# Altium schematic sheet DRL_Circuit.SchDoc
size A4; SheetNumber: 4; SheetTotal: 7
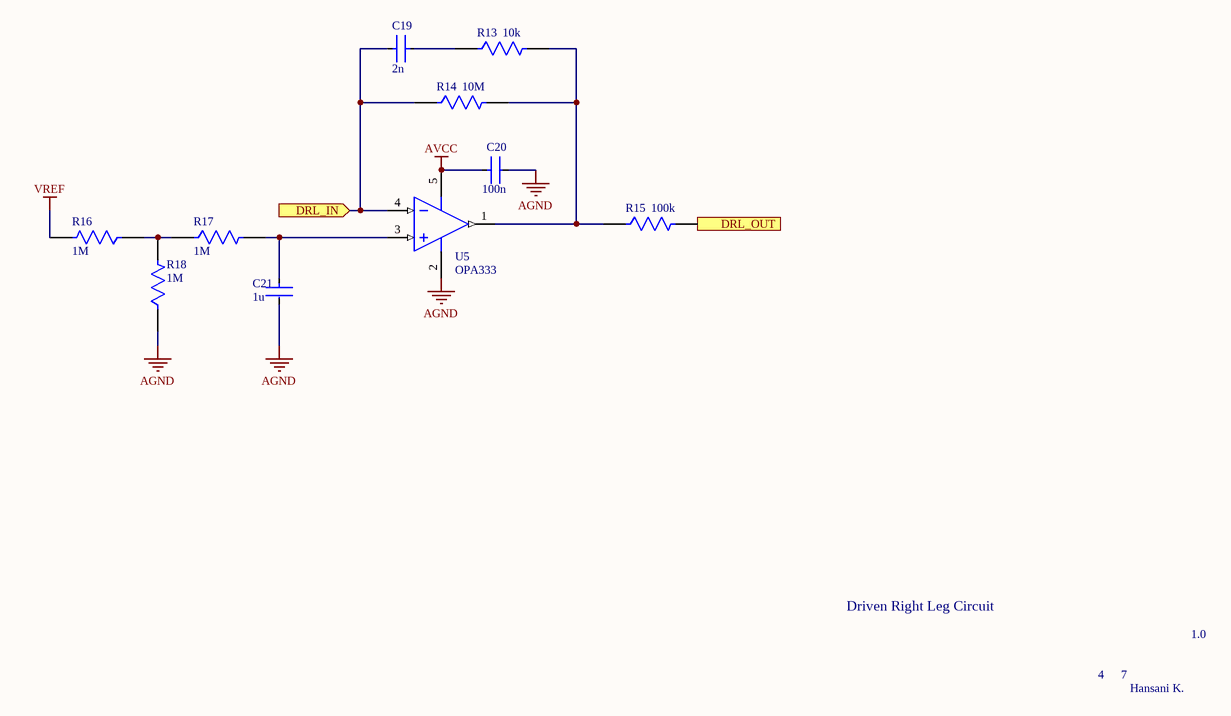
[diagram p0: DRL_Circuit.SchDoc]

## Parts
C19  2n  [PCBComponent_1]
C20  100n  [FP-GRM155-0_05-MFG]
C21  1u  [FP-0603-L_1_6_0_15-W_0_81-IPC_A]
R13  10k  [PCBComponent_1]
R14  10M  [PCBComponent_1]
R15  100k  [PCBComponent_1]
R16  1M  [PCBComponent_1]
R17  1M  [FP-RK73H2A-IPC_A]
R18  1M  [PCBComponent_1]
U5  OPA333  [DBV0005A_M]

## Ports
DRL_IN (in, see Wireless_ECG_Monitor[2C], Instrumentation_Amp[3B]), DRL_OUT (out, see Wireless_ECG_Monitor[1C])

## Nets
AGND: C20.2 C21.2 R18.1 U5.2(V-)
AVCC: C20.1 U5.5(V+)
VREF: R16.2
DRL_IN: C19.1 R14.1 U5.4(IN-) ; port DRL_IN
DRL_OUT: R15.2 ; port DRL_OUT
NetC19_2: C19.2 R13.1
NetC21_1: C21.1 R17.2 U5.3(IN+)
NetR13_2: R13.2 R14.2 R15.1 U5.1(OUT)
NetR16_1: R16.1 R17.1 R18.2

## Notes on the sheet
- Driven Right Leg Circuit
- 4
- 7
- 1.0
- Hansani K.

## Library data of the parts
C19 = 08051C202JAT2A: Cap Ceramic 0.002uF 100V X7R 5% SMD 0805 125°C T/R; Manufacturer: KYOCERA AVX; Value: 2nF; Supplier: Mouser; Supplier Part Number: 581-08051C202JAT2A; Manufacturer Part Number: 08051C202JAT2A; RoHS: Compliant; Category: Ceramic Capacitors; Stock: 7036; Pricing: 1=0.26, 10=0.167, 50=0.167, 100=0.099, 1000=0.072, 10000=0.047 (USD); Case/Package: 0805; Case Code (Imperial): 0805; Case Code (Metric): 2012; Depth: 1.25mm; Dielectric: X7R; Length: 2.01mm; Max Operating Temperature: 125°C; Min Operating Temperature: -55°C; Mounting Technology: Surface Mount; Pins: 2; Packaging: Tape & Reel (TR); Radiation Hardening: No; Termination: SMD/SMT; Thickness: 939.8µm; Tolerance: 5%; Voltage Rating: 100V; Voltage Rating (DC): 100V; Weight: 5.499807mg; Width: 1.25mm; ComponentLink1URL: https://datasheet.octopart.com/08051C202JAT2A-KYOCERA-AVX-datasheet-13516023.pdf; ComponentLink1Description: https://datasheet.octopart.com/08051C202JAT2A-KYOCERA-AVX-datasheet-13516023.pdf; ComponentLink2URL: https://datasheet.octopart.com:443/08051C202JAT2A-KYOCERA-AVX-datasheet-12587061.pdf?src-supplier=Newark; ComponentLink2Description: https://datasheet.octopart.com:443/08051C202JAT2A-KYOCERA-AVX-datasheet-12587061.pdf?src-supplier=Newark; ComponentLink3URL: https://datasheet.octopart.com:443/08051C202JAT2A-KYOCERA-AVX-datasheet-12509786.pdf?src-supplier=Newark; ComponentLink3Description: https://datasheet.octopart.com:443/08051C202JAT2A-KYOCERA-AVX-datasheet-12509786.pdf?src-supplier=Newark; ComponentLink4URL: http://sigma.octopart.com:80/reach_statement/AVX-company-19.pdf?src-supplier=Compliance+Statements; ComponentLink4Description: http://sigma.octopart.com:80/reach_statement/AVX-company-19.pdf?src-supplier=Compliance+Statements; ComponentLink5URL: http://sigma.octopart.com:80/conflict_mineral_statement/AVX-company-34.pdf?src-supplier=Compliance+Statements; ComponentLink5Description: http://sigma.octopart.com:80/conflict_mineral_statement/AVX-company-34.pdf?src-supplier=Compliance+Statements
C20 = CMP-06035-040303-1: Chip Multilayer Ceramic Capacitors for General Purpose, 0402, 0.10uF, B, 10%, 20%, 50V
C21 = CMP-2006-04474-2: General Purpose Ceramic Capacitor, 0603, 1uF, 10%, X5R, 15%, 6.3V; Insulation Resistance: 100GR; Dissipation Factor: 5%; Package Quantity: 1; Mount: Surface Mount; Series: -; Number of Pins: 2; Length: 1.6mm; RoHS Compliant: Yes; Capacitance: 1uF; Depth: 0.81mm; Case Code (Imperial): 0603; Lead Free: Lead Free; Max Operating Temperature: 85°C; Case Code (Metric): 1608; Min Operating Temperature: -55°C; Contact Plating: Tin; Voltage: 6.3V; Tolerance: 10%; Width: 0.032inch; Voltage Rating (DC): 6.3V; Voltage Rating: 6.3V; Termination: SMD/SMT; Radiation Hardening: No; Case/Package: 0603; Thickness: 0.035inch; Height: 0.9mm; REACH SVHC: No SVHC; Packaging: Tape and Reel; Construction: Flat; Dielectric: X5R
R13-R16 R18 = ERJ-6GEYJ354V: ERJ Thick Film Chip Resistor 0805 350K Ohm 5% 0.125 W 2-Pin Surface Mount Punched Carrier T/R; Manufacturer: Panasonic; Max Power Dissipation: 125mW; Value: 350kΩ; Temperature Coefficient: 200ppm/°C; Supplier: DigiKey; Supplier Part Number: ERJ-6GEYJ354V-ND; Manufacturer Part Number: ERJ-6GEYJ354V; RoHS: Compliant; Category: Chip SMD Resistors; Pricing: 50000=0.00673 (USD); Case/Package: 0805; Composition: Thick Film; Contact Plating: Tin; Features: Automotive AEC-Q200; Height: 711.2µm; Length: 2.0066mm; Max Operating Temperature: 155°C; Min Operating Temperature: -55°C; Number of Terminations: 2; Packaging: Tape & Reel; Power Rating: 125mW; Radiation Hardening: No; Tolerance: 5%; Width: 1.2446mm; ComponentLink1URL: https://datasheet.octopart.com/ERJ-6GEYJ354V-Panasonic-datasheet-78375410.pdf; ComponentLink1Description: https://datasheet.octopart.com/ERJ-6GEYJ354V-Panasonic-datasheet-78375410.pdf; ComponentLink2URL: https://datasheet.octopart.com/Thick-Film-Chip-Resistors-Panasonic-datasheet-family-105.pdf; ComponentLink2Description: https://datasheet.octopart.com/Thick-Film-Chip-Resistors-Panasonic-datasheet-family-105.pdf
R17 = CMP-04015-079219-1: 1MΩ ±1% 0.25W Chip Resistor 0805 Thick Film AEC-Q200 Qualified; Voltage Rating: 150V; Temperature Coefficient: 100ppm/°C; Resistance: 1MR; Power Rating: 125mW; Lead Free: Lead Free; Length: 2mm; Case/Package: 0805; Case Code (Imperial): 0805; Case Code (Metric): 2012; Max Operating Temperature: 155°C; Resistor Type: Thick Film; Termination: SMD/SMT; Min Operating Temperature: -55°C; Tolerance: 1%; Construction: Rectangular; Military Standard: Not; Packaging: Tape and Reel; Depth: 1.25mm; Voltage Rating (DC): 150V; Series: RK73H
U5 = CMP-0272-00841-3: 17 uA, MicroPower, Precision, Zero Drift CMOS Operational Amplifier, 1.8 to 5.5 V, -40 to 125 degC, 5-pin SOT23 (DBV5), Green (RoHS & no Sb/Br); PartNumber: OPA333AIDBVT; Manufacturer: Texas Instruments; Vio (25C)(Max)(mV): 0.01; Sub Family: Low Offset Voltage Amplifier (<=500uV), Low Power Amp (<=500uA), Low Supply Voltage Amplifier (<=2.7V), Precision Amplifier, Zero Drift Precision Amplifier; Iq per channel(Max)(mA): 0.025; CMRR(Min)(dB): 106; Total Supply Voltage(Max)(+5V is 5, +/-5V is 10): 5.5; Number of Channels: 1; Total Supply Voltage(Min)(+5V is 5, +/-5V is 10): 1.8; Slew Rate(Typ)(V/us): 0.16; IIB(Max)(pA): 200; Offset Drift(Typ)(uV/C): 0.02; PackageDescription: 5-Pin Plastic Small Outline, Body 1.6 x 2.9 mm, Pitch 0.95 mm; DatasheetVersion: SBOS351C; ComponentLink1Description: Manufacturer URL; ComponentLink1URL: http://www.ti.com/; ComponentLink3URL: http://www.ti.com/litv/pdf/mpds018i; Code_JEDEC: MO-178; ComponentLink3Description: Package Specification; PackageVersion: 4073253-4/K, 03/2006; PackageReference: DBV0005A; ComponentLink2URL: http://www.ti.com/general/docs/lit/getliterature.tsp?genericPartNumber=OPA333&fileType=pdf; ComponentLink2Description: Datasheet; Eco-Plan: Green (RoHS & no Sb/Br); Mounting Technology: Surface Mount